# Altium schematic sheet 12v_power.SchDoc: 12V Regtulator
size A4; Engineer: Anthony Grana; DocumentNumber: 6; Revision: 1.0; SheetNumber: 6; SheetTotal: 9
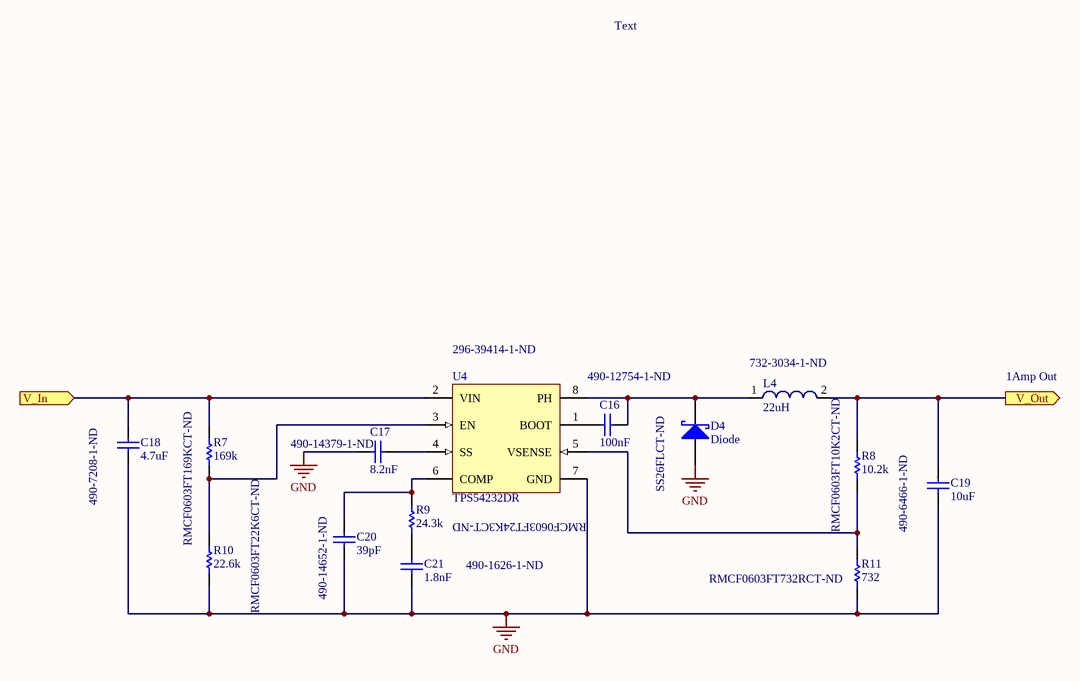
[diagram p0: 12v_power.SchDoc]

## Parts
C16  Capacitance: 100nF  [PCB-lllx3wppxbec679u3f24-1]  (hidden comment: Cap)
C17  Capacitance: 8.2nF  [PCB-lllx3wppxbec679u3f24-1]  (hidden comment: Cap)
C18  Capacitance: 4.7uF  [PCB-lllx3wppxbec679u3f24-1]  (hidden comment: Cap)
C19  Capacitance: 10uF  [PCB-lllx3wppxbec679u3f24-1]  (hidden comment: Cap)
C20  Capacitance: 39pF  [PCB-lllx3wppxbec679u3f24-1]  (hidden comment: Cap)
C21  Capacitance: 1.8nF  [PCB-lllx3wppxbec679u3f24-1]  (hidden comment: Cap)
D4  Diode  [PCB-5gde02dk4bufsuch8kid-1]
L4  22uH  [WE-SPC 4838]
R7  169k  [R0603_A]
R8  10.2k  [R0603_A]
R9  24.3k  [R0603_A]
R10  22.6k  [R0603_A]
R11  732  [R0603_A]
U4  TPS54232DR  [D8_M]

## Ports
V_In (in), V_Out (out)

## Nets
GND: C17.1 C18.2 C19.2 C20.2 C21.2 D4.1(A) R10.1 R11.1 U4.7(GND)
V_In: C18.1 R7.2 U4.2(VIN) ; port V_In
V_Out: C19.1 L4.2 R8.2 ; port V_Out
NetC16_1: C16.1 D4.2(K) L4.1 U4.8(PH)
NetC16_2: C16.2 U4.1(BOOT)
NetC17_2: C17.2 U4.4(SS)
NetC20_1: C20.1 R9.2 U4.6(COMP)
NetC21_1: C21.1 R9.1
NetR7_1: R7.1 R10.2 U4.3(EN)
NetR8_1: R8.1 R11.2 U4.5(VSENSE)

## Notes on the sheet
- Text
- (near U4) 296-39414-1-ND
- 490-12754-1-ND
- (near L4) 732-3034-1-ND
- 1Amp Out
- (near C17) 490-14379-1-ND
- (near C18) 490-7208-1-ND
- RMCF0603FT24K3CT-ND
- SS26FLCT-ND
- RMCF0603FT10K2CT-ND
- 490-6466-1-ND
- RMCF0603FT169KCT-ND
- (near C20) 490-14652-1-ND
- 490-1626-1-ND
- (near R11) RMCF0603FT732RCT-ND
- RMCF0603FT22K6CT-ND
- Title
- Size:
- Date:
- A4
- Engineer:
- Time:
- Sheet
- Revision:
- of
- File:

## Library data of the parts
C16-C21 = CMP-0d44c5e3fbabd283-1: C Series 0805 22 uF 35 V ±10 % Tolerance X5R SMT Multilayer Ceramic Capacitor; Manufacturer Part Number: C2012X5R1V226M125AC; Capacitance Tolerance: ±20%; Case/Package: 0805; OctopartID: 0d44c5e3fbabd283
D4 = CMP-0675ccf66d19d9b2-1: Diode Schottky Barrier Rectifier 60V 2A 2-Pin SOD-123F T/R; Mounting Style: Surface Mount; Digikey URL: http://www.digikey.com/product-detail/en/fairchild-on-semiconductor/SS26FL/SS26FLCT-ND/5305094; OctopartID: 0675ccf66d19d9b2
L4 = CMP-915955-2: SMD Shielded Power Inductor WE-SPC, L=22 µH; Inductance: 2.2e-05 H; Self Resonant Frequency: 19000000.0 Hz; Octopart Url: https://octopart.com/74408943220-w%C3%BCrth+elektronik-22866607; OctopartID: 1e41d617d188c186; Packaging: Cut Tape (CT); REACH SVHC Compliance: No SVHC; RoHS: Compliant
R7-R11 = CMP-d59d1ef5e9b70a5a-2: RC Series 0603 0.1 W 470 Ohms 5% ±100 ppm/°C SMT Thick Film Chip Resistor; Manufacturer Part Number: RC0603JR-07470RL; Power Rating: 0.1 W; Voltage Rating (DC): 50.0 V; Resistance: 470.0; Lead-Free Status: Lead Free; Size-Length: 0.0016 m; Case/Package: 0603; OctopartID: d59d1ef5e9b70a5a; Resistance Tolerance: ±5%; RoHS: Compliant; Seller Landing  Url: https://octopart-clicks.com/click/track?country=US&ak=8157f166&sig=054c9ec&sid=5489&ppid=39983436&vpid=190517122&ct=offers; Number of Pins: 2; Size-Width: 0.0008 m; REACH SVHC Compliance: No SVHC; Mounting Style: Surface Mount; Octopart Url: http://octopart.com/rc0603jr-07470rl-yageo-39983436; Size-Height: 0.00045 m
U4 = CMP-1489251-3: Buck Step Down Regulator with 3.5 to 28 V Input and 0.8 to 25 V Output, -40 to 150 degC, 8-Pin SOIC (D), Green (RoHS & no Sb/Br); Lead-Free Status: Lead Free; Number of Regulated Outputs: 1; Quiescent Current: 8.5e-05 A; Thermal Shutdown: Yes; Case/Package: SOIC; Lifecycle Status: Active; Number of Pins: 8; Octopart Url: https://octopart.com/tps54232dr-texas+instruments-12194538; OctopartID: 358ffc3f0203ea48; RoHS: Compliant; Topology: Buck